# Altium schematic sheet microz.SchDoc: DCSLMiniAutonomousRaceCar_PCB
size 381 x 406 mm; DrawnBy: Agastya Kalagarla; SheetNumber: 1; SheetTotal: 1
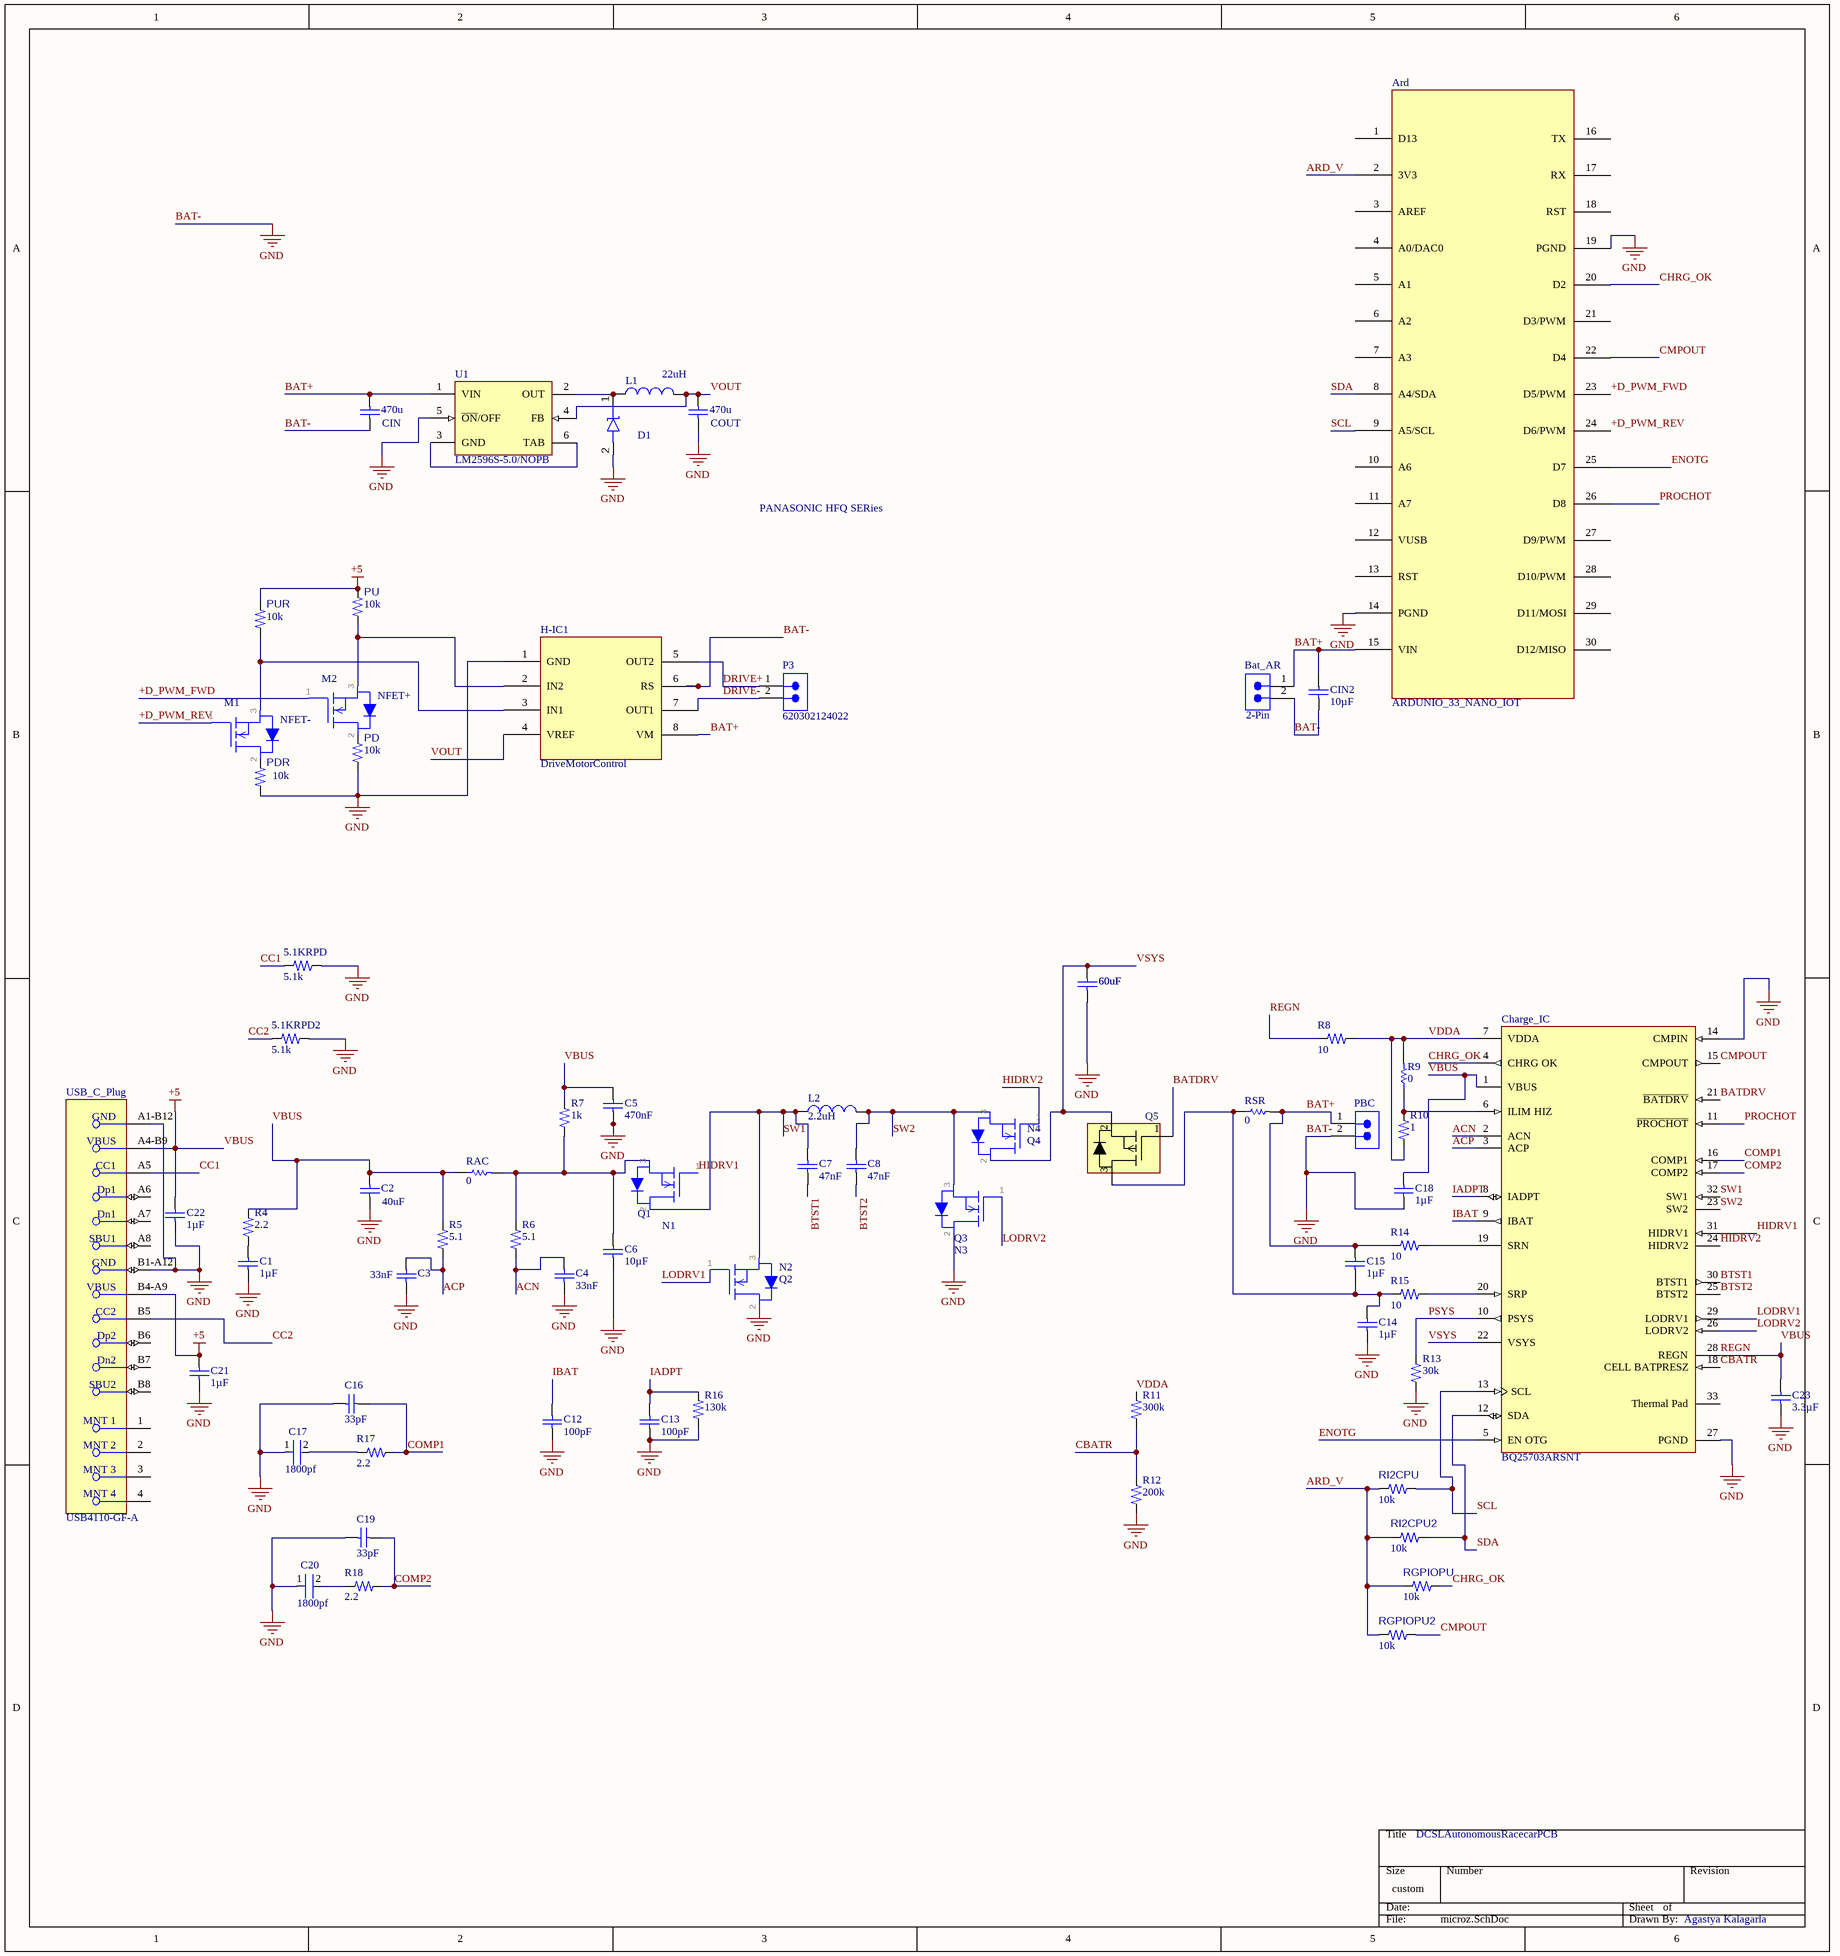
[diagram p0: microz.SchDoc]

## Parts
5.1KRPD  value 5.1k  [RESC0603(1608)_L]  (hidden comment: 5K1 0.1 0603)
5.1KRPD2  value 5.1k  [RESC0603(1608)_L]  (hidden comment: 5K1 0.1 0603)
60uF  value 60uF  [RESC0603(1608)_L]  (hidden comment: 0603-CAP)
Ard  ARDUNIO_33_NANO_IOT  [Arduino33NanoIOT]
Bat_AR  2-Pin  [620302124022]
C1  value 1µF  [RESC0402(1005)_L]  (hidden comment: Capacitor 1u)
C2  value 40uF  [RESC0603(1608)_L]  (hidden comment: 0603-CAP)
C3  value 33nF  [RESC0603(1608)_L]  (hidden comment: Capacitor 33n)
C4  value 33nF  [RESC0603(1608)_L]  (hidden comment: Capacitor 33n)
C5  value 470nF  [RESC0603(1608)_L]  (hidden comment: Capacitor 470n)
C6  value 10µF  [RESC0805(2012)_L]  (hidden comment: Capacitor 10u)
C7  value 47nF  [RESC0603(1608)_L]  (hidden comment: Capacitor 47n)
C8  value 47nF  [RESC0603(1608)_L]  (hidden comment: Capacitor 47n)
C12  value 100pF  [RESC0603(1608)_L]  (hidden comment: Capacitor 100p)
C13  value 100pF  [RESC0603(1608)_L]  (hidden comment: Capacitor 100p)
C14  value 1µF  [RESC0402(1005)_L]  (hidden comment: Capacitor 1u)
C15  value 1µF  [RESC0402(1005)_L]  (hidden comment: Capacitor 1u)
C16  value 33pF  [RESC0603(1608)_L]  (hidden comment: Capacitor 33p)
C17  1800pf  [FP-GRM188-0_1-e0_2_0_5-IPC_A]
C18  value 1µF  [RESC0402(1005)_L]  (hidden comment: Capacitor 1u)
C19  value 33pF  [RESC0603(1608)_L]  (hidden comment: Capacitor 33p)
C20  1800pf  [FP-GRM188-0_1-e0_2_0_5-IPC_A]
C21  value 1µF  [RESC0402(1005)_L]  (hidden comment: Capacitor 1u)
C22  value 1µF  [RESC0402(1005)_L]  (hidden comment: Capacitor 1u)
C23  value 3.3µF  [RESC0603(1608)_L]  (hidden comment: Capacitor 3u3)
Charge_IC  BQ25703ARSNT  [FP-RSN0032B-MFG]
CIN  value 470u  [RESC0603(1608)_L]  (hidden comment: 0603-CAP)
CIN2  value 10µF  [RESC0805(2012)_L]  (hidden comment: Capacitor 10u)
COUT  value 470u  [RESC0603(1608)_L]  (hidden comment: 0603-CAP)
D1  DIODE_SCHOTTKY_SOD-323  [SOD-323]  (value not drawn)
H-IC1  DriveMotorControl  [TB67H451FNG,EL]
L1  22uH  [INDC3225X24N]
L2  value 2.2uH  [INDC3225X24N]  (hidden comment: IND_1210)
N1  Q1  [DPAK(2-7K1S)]
N2  Q2  [DPAK(2-7K1S)]
N3  Q3  [DPAK(2-7K1S)]
N4  Q4  [DPAK(2-7K1S)]
NFET+  M2  [DPAK(2-7K1S)]
NFET-  M1  [DPAK(2-7K1S)]
P3  620302124022  [620302124022]
PBC  620302124022  [620302124022]  (value not drawn)
PD  value 10k  [RESC0603(1608)_L]  (hidden comment: 10K 0.1 0603)
PDR  value 10k  [RESC0603(1608)_L]  (hidden comment: 10K 0.1 0603)
PU  value 10k  [RESC0603(1608)_L]  (hidden comment: 10K 0.1 0603)
PUR  value 10k  [RESC0603(1608)_L]  (hidden comment: 10K 0.1 0603)
Q5  DMP3056L-7  [SOT96P240X110-3N/SOT23-3]  (value not drawn)
R4  value 2.2  [RESC0603(1608)_L]  (hidden comment: 2R2 5 0603)
R5  value 5.1  [RESC0603(1608)_L]  (hidden comment: 5R1 5 0603)
R6  value 5.1  [RESC0603(1608)_L]  (hidden comment: 5R1 5 0603)
R7  value 1k  [RESC0603(1608)_L]  (hidden comment: 1K 0.1 0603)
R8  value 10  [RESC0603(1608)_L]  (hidden comment: 10R 0.1 0603)
R9  value 0  [RESC1005X40X25ML05T05]  (hidden comment: Resistor 0R +/- 5% 0402 100 mW)
R10  value 1  [RESC0603(1608)_L]  (hidden comment: 1R 5 0603)
R11  value 300k  [RESC0603(1608)_L]  (hidden comment: 300K 0.1 0603)
R12  value 200k  [RESC0603(1608)_L]  (hidden comment: 200K 0.1 0603)
R13  value 30k  [RESC0603(1608)_L]  (hidden comment: 30K 0.1 0603)
R14  value 10  [RESC0603(1608)_L]  (hidden comment: 10R 0.1 0603)
R15  value 10  [RESC0603(1608)_L]  (hidden comment: 10R 0.1 0603)
R16  value 130k  [RESC0603(1608)_L]  (hidden comment: 130K 0.1 0603)
R17  value 2.2  [RESC0603(1608)_L]  (hidden comment: 2R2 5 0603)
R18  value 2.2  [RESC0603(1608)_L]  (hidden comment: 2R2 5 0603)
RAC  value 0  [RESC1005X40X25ML05T05]  (hidden comment: Resistor 0R +/- 5% 0402 100 mW)
RGPIOPU  value 10k  [RESC0603(1608)_L]  (hidden comment: 10K 0.1 0603)
RGPIOPU2  value 10k  [RESC0603(1608)_L]  (hidden comment: 10K 0.1 0603)
RI2CPU  value 10k  [RESC0603(1608)_L]  (hidden comment: 10K 0.1 0603)
RI2CPU2  value 10k  [RESC0603(1608)_L]  (hidden comment: 10K 0.1 0603)
RSR  value 0  [RESC1005X40X25ML05T05]  (hidden comment: Resistor 0R +/- 5% 0402 100 mW)
U1  LM2596S-5.0/NOPB  [KTT0005B_M]
USB_C_Plug  USB4110-GF-A  [FP-USB4110-GF-A-MFG]

## Nets
BAT-: 5.1KRPD.2 5.1KRPD2.2 60uF.1 Ard.14(PGND) Ard.19(PGND) Bat_AR.2 C1.1 C2.1 C3.1 C4.1 C5.1 C6.1 C12.1 C13.1 C14.1 C16.1 C17.1 C18.1 C19.1 C20.1 C21.1 C22.1 C23.1 Charge_IC.14(CMPIN) Charge_IC.27(PGND) CIN.1 CIN2.1 COUT.1 D1.2(A) H-IC1.1(GND) H-IC1.6(RS) N2.2(Drain) N3.2(Drain) PBC.2 PD.1 PDR.1 R12.1 R13.1 R16.1 U1.5(~{ON}/OFF) USB_C_Plug.A1-B12(GND) USB_C_Plug.B1-A12(GND)  [also labelled GND]
REGN: C2.2 C5.2 C18.2 C21.2 C22.2 C23.2 Charge_IC.1(VBUS) Charge_IC.28(REGN) PU.2 PUR.2 R4.2 R5.2 R7.2 R8.1 RAC.1 USB_C_Plug.A4-B9(VBUS) USB_C_Plug.B4-A9(VBUS)  [also labelled +5, VBUS]
+D_PWM_FWD: Ard.23(D5/PWM) NFET+.1(Gate)
+D_PWM_REV: Ard.24(D6/PWM) NFET-.1(Gate)
ACN: C4.2 Charge_IC.2(ACN) R6.1
ACP: C3.2 Charge_IC.3(ACP) R5.1
ARD_V: Ard.2(3V3) RGPIOPU.1 RGPIOPU2.1 RI2CPU.1 RI2CPU2.1
BAT+: Ard.15(VIN) Bat_AR.1 C15.2 CIN.2 CIN2.2 H-IC1.8(VM) PBC.1 R14.1 RSR.2 U1.1(VIN)
BATDRV: Charge_IC.21(~{BATDRV}) Q5.1(G)
BTST1: C7.1 Charge_IC.30(BTST1)
BTST2: C8.1 Charge_IC.25(BTST2)
CBATR: Charge_IC.18(CELL_BATPRESZ) R11.1 R12.2
CC1: 5.1KRPD.1 USB_C_Plug.A5(CC1)
CC2: 5.1KRPD2.1 USB_C_Plug.B5(CC2)
CHRG_OK: Ard.20(D2) Charge_IC.4(CHRG_OK) RGPIOPU.2
CMPOUT: Ard.22(D4) Charge_IC.15(CMPOUT) RGPIOPU2.2
COMP1: C16.2 Charge_IC.16(COMP1) R17.1
COMP2: C19.2 Charge_IC.17(COMP2) R18.1
DRIVE+: H-IC1.5(OUT2) P3.1
DRIVE-: H-IC1.7(OUT1) P3.2
ENOTG: Ard.25(D7) Charge_IC.5(EN_OTG)
HIDRV1: Charge_IC.31(HIDRV1) N1.1(Gate)
HIDRV2: Charge_IC.24(HIDRV2) N4.1(Gate)
IADPT: C13.2 Charge_IC.8(IADPT) R16.2
IBAT: C12.2 Charge_IC.9(IBAT)
LODRV1: Charge_IC.29(LODRV1) N2.1(Gate)
LODRV2: Charge_IC.26(LODRV2) N3.1(Gate)
PROCHOT: Ard.26(D8) Charge_IC.11(~{PROCHOT})
PSYS: Charge_IC.10(PSYS) R13.2
SCL: Ard.9(A5/SCL) Charge_IC.13(SCL) RI2CPU.2
SDA: Ard.8(A4/SDA) Charge_IC.12(SDA) RI2CPU2.2
SW1: C7.2 Charge_IC.32(SW1) L2.1 N1.2(Drain) N2.3(Source)
SW2: C8.2 Charge_IC.23(SW2) L2.2 N3.3(Source) N4.3(Source)
VDDA: Charge_IC.7(VDDA) R8.2 R9.2 R10.1 R11.2
VOUT: COUT.2 H-IC1.4(VREF) L1.2 U1.4(FB)
VSYS: 60uF.2 Charge_IC.22(VSYS) N4.2(Drain) Q5.2(S)
NetC1_2: C1.2 R4.1
NetC6_2: C6.2 N1.3(Source) R6.2 R7.1 RAC.2
NetC14_2: C14.2 C15.1 Q5.3(D) R15.1 RSR.1
NetC17_2: C17.2 R17.2
NetC20_2: C20.2 R18.2
NetCharge_IC_6: Charge_IC.6(ILIM_HIZ) R9.1 R10.2
NetCharge_IC_19: Charge_IC.19(SRN) R14.2
NetCharge_IC_20: Charge_IC.20(SRP) R15.2
NetD1_1: D1.1(K) L1.1 U1.2(OUT)
NetH-IC1_2: H-IC1.2(IN2) NFET+.3(Source) PU.1
NetH-IC1_3: H-IC1.3(IN1) NFET-.3(Source) PUR.1
NetNFET+_2: NFET+.2(Drain) PD.2
NetNFET-_2: NFET-.2(Drain) PDR.2
NetU1_3: U1.3(GND) U1.6(TAB)

Not connected (* = marked no-connect by the designer): Ard 1(D13) 3(AREF) 4(A0/DAC0) 5(A1) 6(A2) 7(A3) 10(A6) 11(A7) 12(VUSB) 13(RST) 16(TX) 17(RX) 18(RST) 21(D3/PWM) 27(D9/PWM) 28(D10/PWM) 29(D11/MOSI) 30(D12/MISO); Charge_IC 33(Thermal_Pad); USB_C_Plug 1(MNT_1) 2(MNT_2) 3(MNT_3) 4(MNT_4) A6(Dp1) A7(Dn1) A8(SBU1) B6(Dp2) B7(Dn2) B8(SBU2)

## Notes on the sheet
- PANASONIC HFQ SERies
- DCSLAutonomousRacecarPCB
- Agastya Kalagarla

## Library data of the parts
5.1KRPD 5.1KRPD2 = CMP-009-01454-3: 0603 (1608 Metric) 1/10 W 5K1 1 Precision Thick Film Chip Resistor; Case-EIA: 0603; Power: 100mW; Tolerance: 0.1%
60uF C2 CIN COUT = CMP-001-00083-4: Imperial 0603 Capacitor; Case/Package: 0603
Ard = ARDUNIO_33_NANO_IOT: Arduino Nano IC for I2C Comms/Control
Bat_AR P3 PBC = CMP-1502-00660-2: NexarPartId: 18818242; Insulation: Insulated; Connector Type: Male Pin; Pitch: 2mm; Insulation Resistance: 1GΩ; Gender: Male; Voltage Rating: 125V; Number of Positions: 2; Contact Resistance: 20mΩ; Operating Supply Voltage: 100V; Current Rating: 2A; Contact Material: Copper; Number of Rows: 1; Flammability Rating: UL94 V-0; Housing Material: Nylon; Lead Pitch: 2mm; Orientation: Vertical; Max Operating Temperature: 85°C; Termination: SMD/SMT; REACH SVHC: Unknown; Contact Mating Length: 3.5052mm; RoHS: Compliant; Packaging: Tape and Reel; Number of Contacts: 2; Height: 6.6mm; Mount: Surface Mount; Number of Pins: 2; Contact Gender: Male; Min Operating Temperature: -40°C; Length: 5mm; Width: 7.9mm; Contact Plating: Tin; Color: Beige, White
C1 C14 C15 C18 C21 C22 = CMP-001-00736-2: Chip Capacitor, 1u 25V 0402 X7R; Capacitor Type: X7R; Voltage Rating: 25V; Case/Package: 0402
C3 C4 = CMP-001-00783-2: Chip Capacitor, 33n 10V 0603 X7R; Capacitor Type: X7R; Case/Package: 0603; Voltage Rating: 10V
C5 = CMP-001-00951-2: Chip Capacitor, 470n 50V 0603 X7R; Voltage Rating: 50V; Capacitor Type: X7R; Case/Package: 0603
C6 = CMP-001-00968-2: Chip Capacitor, 10u 25V 0805 X7R; Case/Package: 0805; Voltage Rating: 25V; Capacitor Type: X7R
C7 C8 = CMP-001-00939-2: Chip Capacitor, 47n 50V 0603 X7R; Case/Package: 0603; Voltage Rating: 50V; Capacitor Type: X7R
C12 C13 = CMP-001-00907-2: Chip Capacitor, 100p 50V 0603 X7R; Case/Package: 0603; Voltage Rating: 50V; Capacitor Type: X7R
C16 C19 = CMP-001-00901-2: Chip Capacitor, 33p 50V 0603 X7R; Case/Package: 0603; Capacitor Type: X7R; Voltage Rating: 50V
C17 C20 = CMP-2006-02619-2: Chip Multilayer Ceramic Capacitors for General Purpose, 0603, 1800pF, C0G, 30ppm/°C, 5%, 50V; Capacitance: 1.8nF; Max Operating Temperature: 125°C; Width: 0.031inch; Lead Free: Lead Free; Radiation Hardening: No; Tolerance: 5%; Case/Package: 0603; Min Operating Temperature: -55°C; Termination: SMD/SMT; REACH SVHC: No SVHC; Depth: 0.8mm; Voltage Rating (DC): 50V; Dielectric: C0G; Mount: Surface Mount; Length: 1.6mm; Case Code (Metric): 1608; Temperature Coefficient: 30ppm/°C; Packaging: Tape and Reel; Voltage Rating: 50V; Voltage: 50V; Case Code (Imperial): 0603; Thickness: 0.035inch; Package Quantity: 1; Height: 0.8mm
C23 = CMP-001-00961-2: Chip Capacitor, 3u3 50V 0603 X7R; Capacitor Type: X7R; Voltage Rating: 50V; Case/Package: 0603
Charge_IC = CMP-04911-000011-1: IC BATT MON MULTI-CHEM 32WQFN; Manufacturer: Texas Instruments; Output Current: 6.35A; Min Supply Voltage: 3.5V; Standoff Height: 0mm; Max Supply Voltage: 24V; Max Junction Temp: +125°C; Output Voltage: 19.2V; Number Of Cells: 4; Octopart: https://octopart.com/bq25703arsnt-texas+instruments-81848930; Ambient Temperature Range Low: -40°C; Ambient Temperature Range High: +85°C; Package: RSN0032B; Mouser Description: NVDC I2C Battery Buck-Boost Charge Controller with System Power Monitor & Processor 32-QFN -40 to 85; ComponentLink2Description: Datasheet; RoHS: TRUE; Category: IC; Device Class L1: Integrated Circuits (ICs); Temperature: -40°C to +125°C; Digikey Description: IC BATT MON MULTI-CHEM 32WQFN; Height: 0.8mm; ComponentLink2URL: http://www.ti.com/lit/ds/symlink/bq25703a.pdf; Temperature Range Low: -40°C; Device Class L3: Battery Management; Automotive: No; Device Class L2: Power Management ICs; Lead Free: Yes; Temperature Range High: +125°C; Manufacturer Part Number: BQ25703ARSNT
CIN2 = CMP-001-00971-2: Chip Capacitor, 10u 50V 0805 X7R; Voltage Rating: 50V; Case/Package: 0805; Capacitor Type: X7R
D1 = CMP-004-00034-2: Schottky Diode with SOD-323 Footprint
H-IC1 = DriveMotorControl: H-Bridge IC
L1 L2 = CMP-006-00021-1: 1210 Inductor; Case/Package: 1210
N1-N4 NFET+ NFET- = CMP-013-00035-2: N Channel MOSFET, DPAK(2-7K1S) Footprint; Transistor Type: N Channel MOSFET
PD PDR PU PUR RGPIOPU RGPIOPU2 RI2CPU RI2CPU2 = CMP-009-01057-2: 0603 (1608 Metric) 1/10 W 10K 1 Precision Thick Film Chip Resistor; Power: 100mW; Tolerance: 0.1%; Case-EIA: 0603
Q5 = CMP-047-000001-2: P-MOSFET Enhancement Mode; MANUFACTURER: Diodes Incorporated; DeviceName: SOT-23; GateName_1: G$1; SymbolName_1: MOSFET_P-CHANNEL; DKPN: DMP3056L-7DITR-ND; MOPN: 621-DMP3056L-7; DeviceSetName: TRANSISTOR_P_MOS_?_*; LibraryName: HyTechDevices; Design Item ID: DMP3056L-7; ComponentLink1URL: https://www.mouser.com/datasheet/2/115/DIOD_S_A0012915142_1-2543925.pdf; ComponentLink1Description: Datasheet; Source: LOGICFETS.SchLib; MPN: DMP3056L-7; Package: SOT-23
R4 R17 R18 = CMP-0103-0519-5: 0603 (1608 Metric) 1/10 W 2R2 5 Thick Film Chip Resistor; Power: 100mW; Temp. Coefficent: ±500; Tolerance: 5%; Case-EIA: 0603; Case-Metric: 1608; Technology: SMT
R5 R6 = CMP-0103-0528-5: 0603 (1608 Metric) 1/10 W 5R1 5 Thick Film Chip Resistor; Case-EIA: 0603; Power: 100mW; Tolerance: 5%; Case-Metric: 1608; Temp. Coefficent: ±500; Technology: SMT
R7 = CMP-009-01111-3: 0603 (1608 Metric) 1/10 W 1K 1 Precision Thick Film Chip Resistor; Tolerance: 0.1%; Case-EIA: 0603; Power: 100mW
R8 R14 R15 = CMP-009-01062-3: 0603 (1608 Metric) 1/10 W 10R 1 Precision Thick Film Chip Resistor; Case-EIA: 0603; Power: 100mW; Tolerance: 0.1%
R9 RAC RSR = CMP-009-00005-5: Chip Resistor, 0 Ohm, 0.1 W, -55 to 155 degC, 0402 (1005 Metric); Power: 100mW; Voltage Rating: 50V; Pins: 2; Tolerance: 5%; Case/Package: 0402; Mounting Technology: SM; Max Operating Temperature: 155°C; Min Operating Temperature: -55°C; RoHS Compliant: True
R10 = CMP-0103-0511-5: 0603 (1608 Metric) 1/10 W 1R 5 Thick Film Chip Resistor; Power: 100mW; Case-Metric: 1608; Tolerance: 5%; Temp. Coefficent: ±500; Case-EIA: 0603; Technology: SMT
R11 = CMP-009-01410-5: 0603 (1608 Metric) 1/10 W 300K 1 Precision Thick Film Chip Resistor; Case-EIA: 0603; Power: 100mW; Tolerance: 0.1%
R12 = CMP-009-01140-3: 0603 (1608 Metric) 1/10 W 200K 1 Precision Thick Film Chip Resistor; Tolerance: 0.1%; Case-EIA: 0603; Power: 100mW
R13 = CMP-009-01412-5: 0603 (1608 Metric) 1/10 W 30K 1 Precision Thick Film Chip Resistor; Tolerance: 0.1%; Power: 100mW; Case-EIA: 0603
R16 = CMP-009-01079-3: 0603 (1608 Metric) 1/10 W 130K 1 Precision Thick Film Chip Resistor; Power: 100mW; Tolerance: 0.1%; Case-EIA: 0603
U1 = CMP-0069-00269-3: SIMPLE SWITCHER® Power Converter 150 KHz 3A Step-Down Voltage Regulator, 5-pin TO-263, Pb-Free; Manufacturer: Texas Instruments; PowerWise: N; PackageTopMarking: NSUZXYTTE#*LM2596S*-5.0 P+; ComponentLink1URL: http://www.ti.com/general/docs/lit/getliterature.tsp?genericPartNumber=LM2596&fileType=pdf; PackageDescription: TO-263, Molded, .400 x .390 x .180in, 5 Lead, .067in Pitch, Surface Mount; RoHS: Y; PinCount: 5; Code_JEDEC: MO-169-AB; ComponentLink1Description: Datasheet URL; PackageReference: KTT0005B; CompType: Switcher
USB_C_Plug = CMP-245163-000002-1: CONN USB 2.0 TYPE-C R/A SMT; Manufacturer: GCT; Conn Orientation: Right Angle; Usb Standard: USB 2.0; Voltage Rating: 20V; Current Rating: 3/4.25/1.25/0.25A; Number Of Contacts: 16; Is Female: yes; Shielding: true; Standoff Height: 0.1mm; Octopart: https://octopart.com/usb4110-gf-a-gct-103941985; Temperature: -40°C to +85°C; RoHS: TRUE; Automotive: No; Contact Material: Gold,Nickel; Device Class L1: Connectors; Device Class L2: USB Connectors; Package: 0; Lead Free: Yes; ComponentLink2URL: https://gct.co/files/drawings/usb4110.pdf; Temperature Range High: +85°C; Temperature Range Low: -40°C; Height: 3.46mm; Manufacturer Part Number: USB4110-GF-A; ComponentLink2Description: Datasheet; Device Class L3: unset; Digikey Description: CONN USB 2.0 TYPE-C R/A SMT; Category: Conn